# EAGLE design button_connector (EAGLE 6.6.0)
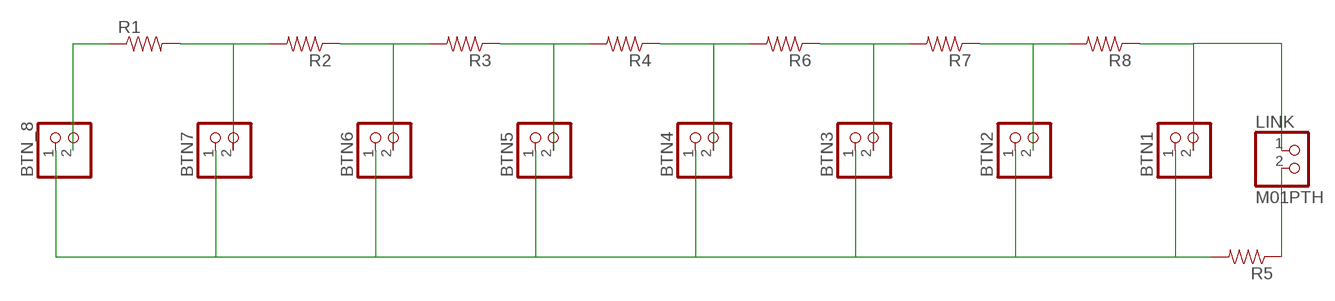
[diagram p0: schematic, sheet 1]

## Parts
BTN1  PINHD-1X2  [1X02]
BTN2  PINHD-1X2  [1X02]
BTN3  PINHD-1X2  [1X02]
BTN4  PINHD-1X2  [1X02]
BTN5  PINHD-1X2  [1X02]
BTN6  PINHD-1X2  [1X02]
BTN7  PINHD-1X2  [1X02]
BTN_8  PINHD-1X2  [1X02]
LINK  M01PTH  PINHD-1X2  [1X02]
R1  RESISTORPTH1  [AXIAL-0.3]
R2  RESISTORPTH1  [AXIAL-0.3]
R3  RESISTORPTH1  [AXIAL-0.3]
R4  RESISTORPTH1  [AXIAL-0.3]
R5  RESISTORPTH1  [AXIAL-0.3]
R6  RESISTORPTH1  [AXIAL-0.3]
R7  RESISTORPTH1  [AXIAL-0.3]
R8  RESISTORPTH1  [AXIAL-0.3]

## Nets
A5: BTN1.2 LINK.1 R8.P$1
GND: BTN1.1 BTN2.1 BTN3.1 BTN4.1 BTN5.1 BTN6.1 BTN7.1 BTN_8.1 R5.P$2
N$1: LINK.2 R5.P$1
N$2: BTN_8.2 R1.P$1
N$3: BTN7.2 R1.P$2 R2.P$2
N$4: BTN6.2 R2.P$1 R3.P$2
N$5: BTN5.2 R3.P$1 R4.P$2
N$6: BTN4.2 R4.P$1 R6.P$2
N$7: BTN3.2 R6.P$1 R7.P$2
N$8: BTN2.2 R7.P$1 R8.P$2

## Library data of the parts
BTN1-BTN7 BTN_8 LINK = pinhead:PINHD-1X2: PIN HEADER
R1-R8 = SparkFun:RESISTOR: Resistor Basic schematic elements and footprints for 0603, 1206, and PTH 1/10th watt (small) resistors.

## Board
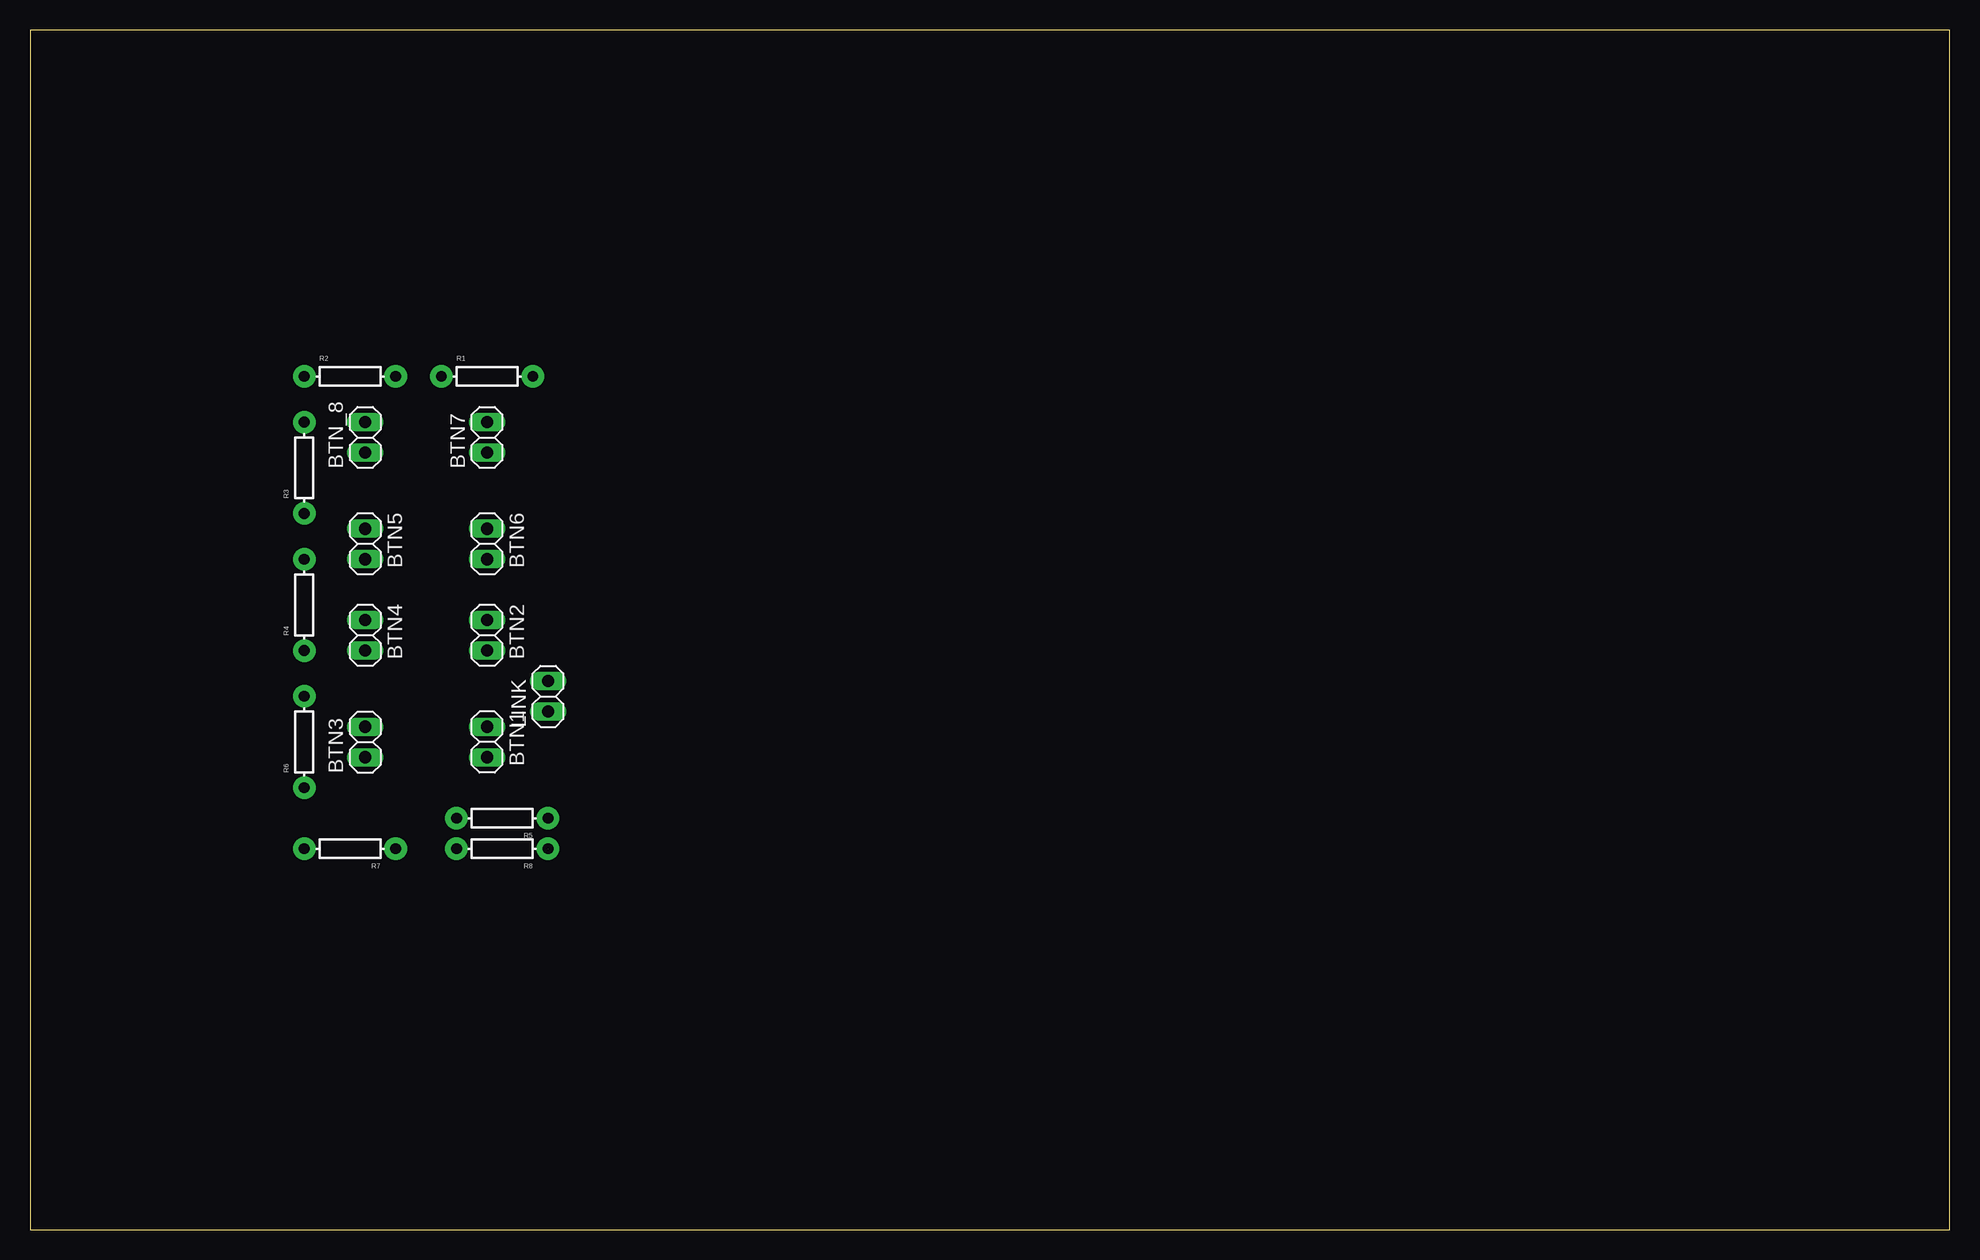
[diagram p1: board, top side]
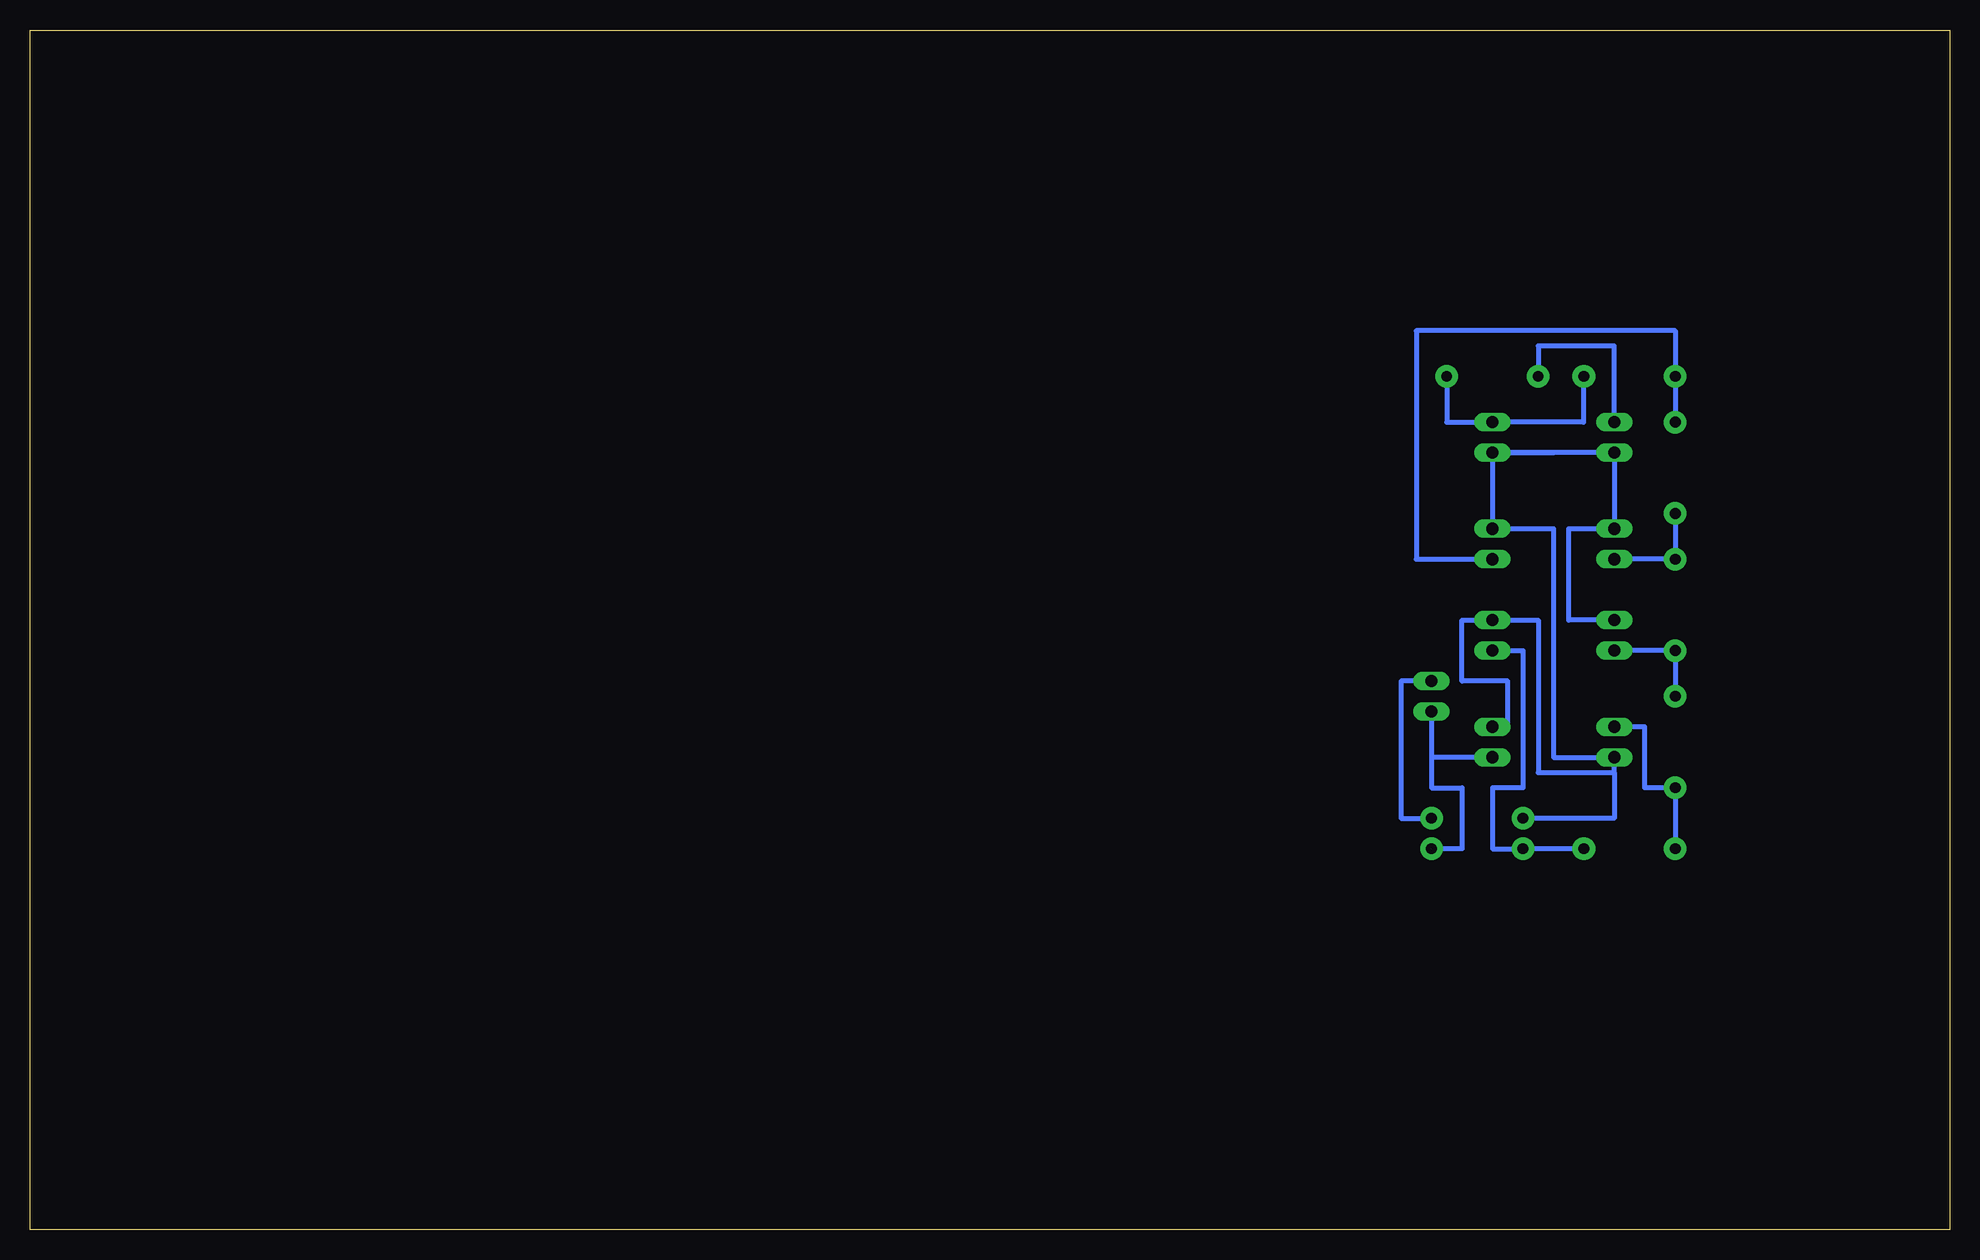
[diagram p2: board, bottom side, seen from below]

Size 160 x 100 mm. Coordinates in mm from the lower left corner, seen from the top.
Outline: 0,0 160,0 160,100 0,100 0,0
Copper layers (1*16): Top 0.035mm / dielectric 1.5mm / Bottom 0.035mm
Design rules "default": minimum track width 10mil, minimum drill 24mil, track to track 8mil, track to pad 8mil, pad to pad 8mil, via to via 8mil, smd to smd 8mil, copper to edge 40mil, drill to drill 8mil, minimum pad ring 10mil, minimum via ring 8mil, stop-mask expansion 4mil, vias tented up to drill 0mil, thermal gap 10mil

### Footprints (pad centres in the part's own frame; a part is rotated, then mirrored left to right if it is on the bottom)
1X02 = drill 1.016 long: 1 -1.27,0; 2 1.27,0
AXIAL-0.3 = drill 0.9 pad 1.88: P$1 -3.81,0; P$2 3.81,0

### Placement (x,y rotation side)
BTN1  38.1,40.64 270 top
BTN2  38.1,49.53 270 top
BTN3  27.94,40.64 90 top
BTN4  27.94,49.53 270 top
BTN5  27.94,57.15 270 top
BTN6  38.1,57.15 270 top
BTN7  38.1,66.04 90 top
BTN_8  27.94,66.04 90 top
LINK  43.18,44.45 90 top
R1  38.1,71.12 0 top
R2  26.67,71.12 0 top
R3  22.86,63.5 90 top
R4  22.86,52.07 90 top
R5  39.37,34.29 180 top
R6  22.86,40.64 90 top
R7  26.67,31.75 180 top
R8  39.37,31.75 180 top

### Tracks (layer width: path | path; a pad name or v marks a point on that pad's centre or on a via)
A5  (1 unrouted)
  Bottom 0.406: LINK.1 43.18,39.37 | BTN1.2 43.18,39.37 | 43.18,39.37 43.18,36.83 40.64,36.83 40.64,31.75 R8.P$1
GND
  Bottom 0.406: BTN4.1 31.75,50.8 31.75,58.42 BTN5.1 BTN_8.1 BTN7.1 | BTN7.1 33.02,64.77 | BTN7.1 BTN6.1 33.02,58.42 33.02,39.37 BTN3.1 27.94,38.1 | 27.94,38.1 34.29,38.1 34.29,50.8 BTN2.1 40.64,50.8 40.64,45.72 36.83,45.72 36.83,41.91 BTN1.1 | 27.94,38.1 27.94,34.29 R5.P$2
N$1
  Bottom 0.406: R5.P$1 45.72,34.29 45.72,45.72 LINK.2
N$2
  Bottom 0.406: BTN_8.2 27.94,73.66 34.29,73.66 R1.P$1
N$3
  Bottom 0.406: R1.P$2 41.91,67.31 BTN7.2 30.48,67.31 R2.P$2
N$4
  Bottom 0.406: R3.P$2 R2.P$1 22.86,74.93 44.45,74.93 44.45,55.88 BTN6.2
N$5
  Bottom 0.406: R3.P$1 R4.P$2 BTN5.2
N$6
  Bottom 0.406: R6.P$2 R4.P$1 BTN4.2 29.21,48.26
N$7
  Bottom 0.406: R7.P$2 R6.P$1 25.4,36.83 25.4,41.91 BTN3.2
N$8
  Bottom 0.406: R7.P$1 R8.P$2 38.1,31.75 38.1,36.83 35.56,36.83 35.56,48.26 BTN2.2